# EAGLE schematic v1 (EAGLE 6.4)
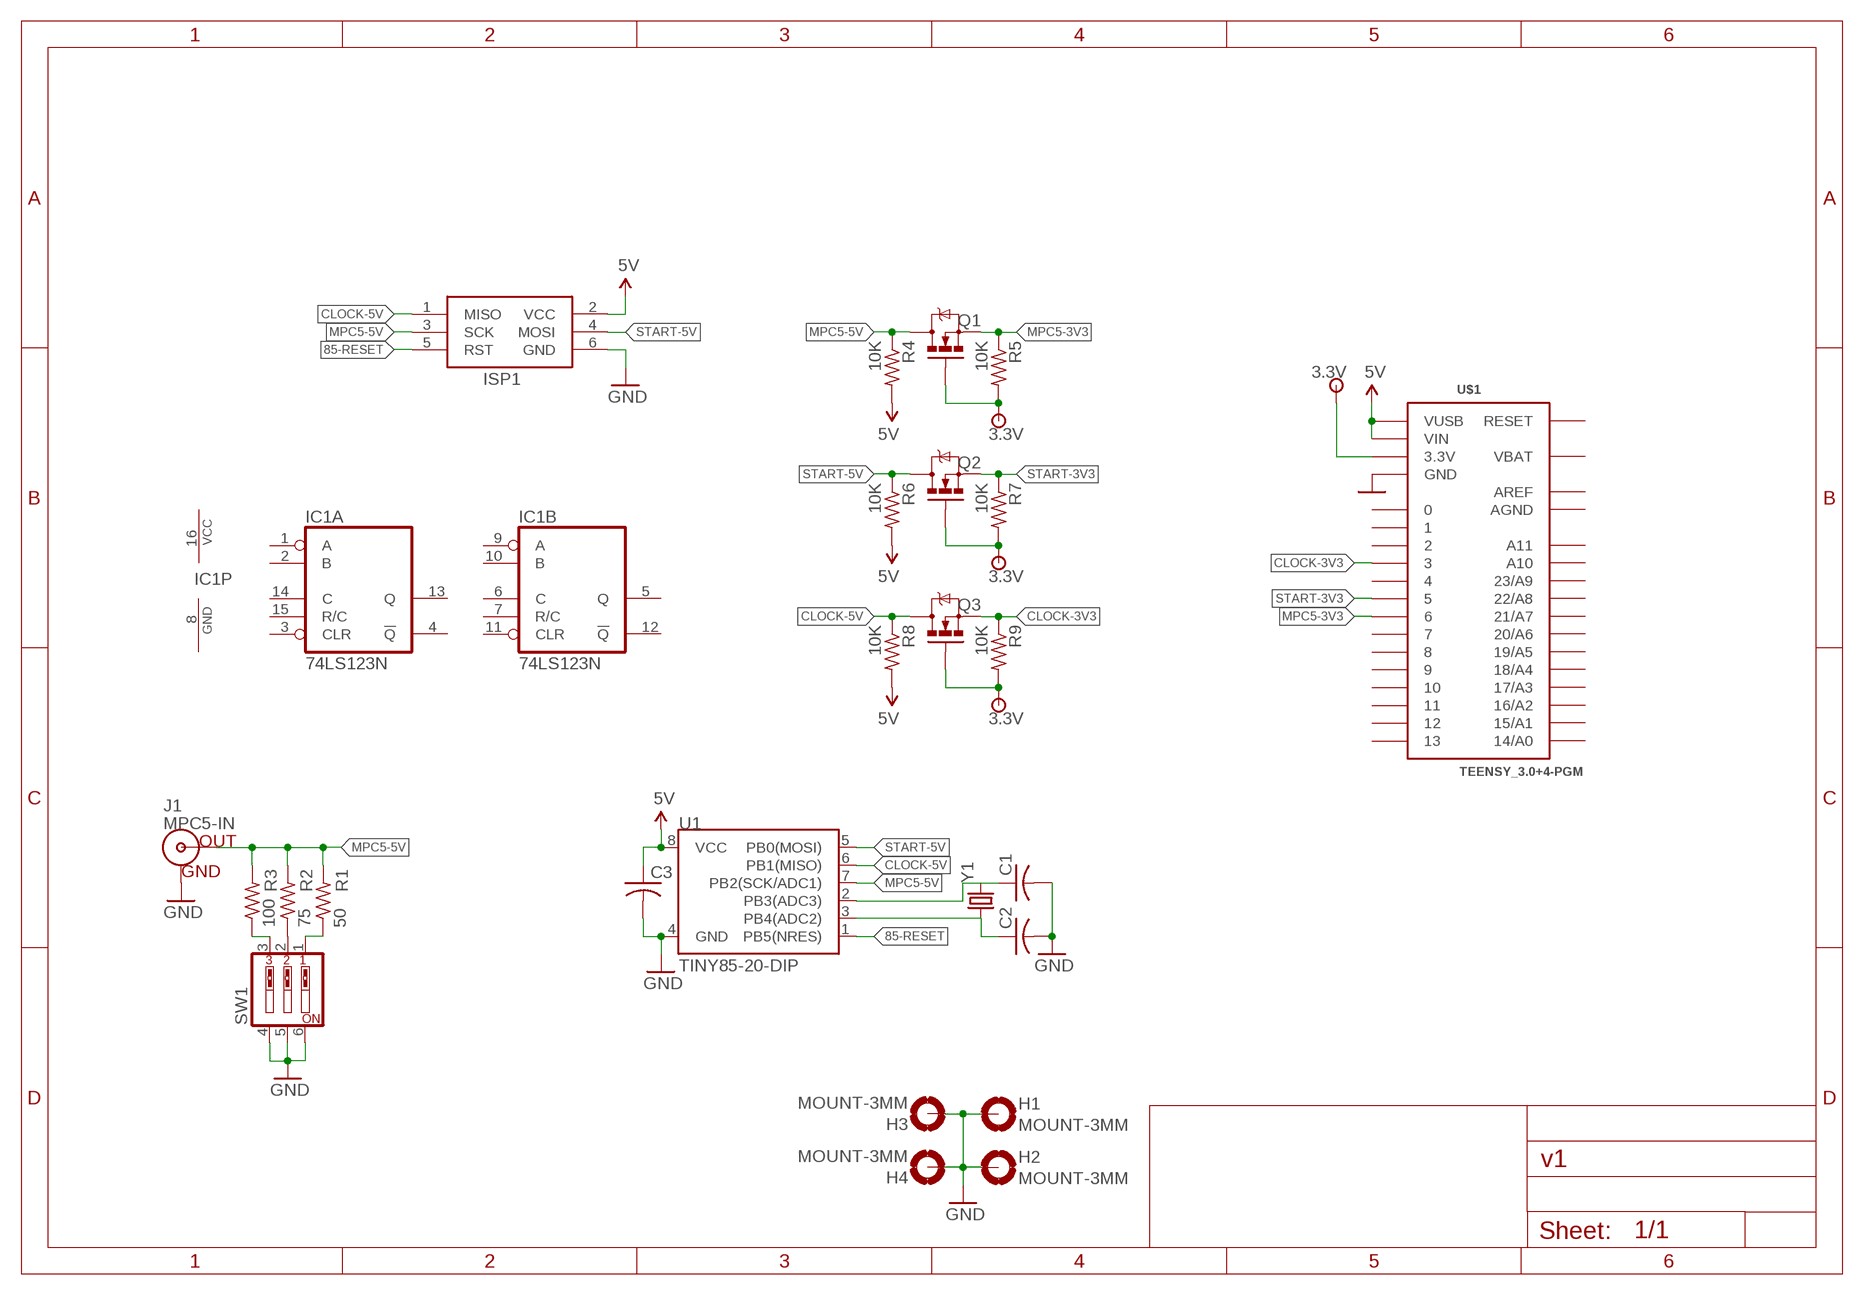
[diagram p0: schematic, sheet 1]

## Parts
C1  C-USNEWSILK  [C0805K]
C2  C-USNEWSILK  [C0805K]
C3  C-USNEWSILK  [C0805K]
H1  MOUNT-3MM  MOUNT-PAD-ROUND3.0  [3,0-PAD]
H2  MOUNT-3MM  MOUNT-PAD-ROUND3.0  [3,0-PAD]
H3  MOUNT-3MM  MOUNT-PAD-ROUND3.0  [3,0-PAD]
H4  MOUNT-3MM  MOUNT-PAD-ROUND3.0  [3,0-PAD]
IC1  74LS123N  [DIL16]
ISP1  AVRISP-6  [AVRISP]
J1  MPC5-IN  BNCPTH  [BNC]
Q1  BSS138  BSS138BSS138  [SOT23]
Q2  BSS138  BSS138BSS138  [SOT23]
Q3  BSS138  BSS138BSS138  [SOT23]
R1  50  R-US_NEWSILK  [R0805]
R2  75  R-US_NEWSILK  [R0805]
R3  100  R-US_NEWSILK  [R0805]
R4  10K  R-US_NEWSILK  [R0805]
R5  10K  R-US_NEWSILK  [R0805]
R6  10K  R-US_NEWSILK  [R0805]
R7  10K  R-US_NEWSILK  [R0805]
R8  10K  R-US_NEWSILK  [R0805]
R9  10K  R-US_NEWSILK  [R0805]
SW1  SW_DIP-3  [EDG-03]
U1  TINY85-20-DIP  ATTINY45TINY85-20-DIP  [DIP08]
U$1  TEENSY_3.0+4-PGM  [TEENSY_3.0+4-PGM]
Y1  CRYSTALHC49UV  [HC49U-V]

## Nets
3.3V: Q1.1(G) Q2.1(G) Q3.1(G) R5.2 R7.2 R9.2 U$1.3.3V U$1.3.3V1(3.3V)
5V: C3.1 ISP1.2(VCC) R4.2 R6.2 R8.2 U1.8(VCC) U$1.VIN U$1.VUSB
85-RESET: ISP1.5(RST) U1.1(PB5(NRES))
CLOCK-3V3: Q3.2(S) R9.1 U$1.3
CLOCK-5V: ISP1.1(MISO) Q3.3(D) R8.1 U1.6(PB1(MISO))
GND: C1.2 C2.2 C3.2 H1.B3,0(MOUNT) H2.B3,0(MOUNT) H3.B3,0(MOUNT) H4.B3,0(MOUNT) ISP1.6(GND) J1.GND SW1.4 SW1.5 SW1.6 U1.4(GND) U$1.GND U$1.GND1(GND)
MPC5-3V3: Q1.2(S) R5.1 U$1.6
MPC5-5V: ISP1.3(SCK) J1.S(OUT) Q1.3(D) R1.2 R2.2 R3.2 R4.1 U1.7(PB2(SCK/ADC1))
N$1: R1.1 SW1.1
N$2: R2.1 SW1.2
N$3: R3.1 SW1.3
N$4: C1.1 U1.2(PB3(ADC3)) Y1.2
N$5: C2.1 U1.3(PB4(ADC2)) Y1.1
START-3V3: Q2.2(S) R7.1 U$1.5
START-5V: ISP1.4(MOSI) Q2.3(D) R6.1 U1.5(PB0(MOSI))
Unconnected: IC1.1(A:A) IC1.2(A:B) IC1.3(A:CLR) IC1.4(A:!Q) IC1.5(B:Q) IC1.6(B:C) IC1.7(B:R/C) IC1.9(B:A) IC1.10(B:B) IC1.11(B:CLR) IC1.12(B:!Q) IC1.13(A:Q) IC1.14(A:C) IC1.15(A:R/C) U$1.0 U$1.1 U$1.2 U$1.4 U$1.7 U$1.8 U$1.9 U$1.10 U$1.11 U$1.12 U$1.13 U$1.14/A0 U$1.15/A1 U$1.16/A2 U$1.17/A3 U$1.18/A4 U$1.19/A5 U$1.20/A6 U$1.21/A7 U$1.22/A8 U$1.23/A9 U$1.A10 U$1.A11 U$1.RESET

## Power pins joined to a net without a drawn wire
AGND: U$1.AGND
AREF: U$1.AREF
GND: IC1.8(P:GND)
VBAT: U$1.VBAT
VCC: IC1.16(P:VCC)

## Library data of the parts
C1-C3 = XYKlib:C-US: CAPACITOR, American symbol
H1-H4 = holes:MOUNT-PAD-ROUND: MOUNTING PAD, round
IC1 = 74xx-us:74*123: Retriggerable monostable MULTIVIBRATOR
ISP1 = adafruit:AVRISP: AVR ISP HEADER Standard 6 pin header for AVR programming
J1 = SparkFun-Connectors:BNC: BNC Connector, Mouser Part# 5227161
Q1-Q3 = XYKlib:BSS138: BSS138 with Outline Silkscreen
R1-R9 = XYKlib:R-US_: RESISTOR, American symbol
SW1 = special:SW_DIP-3: DIP SWITCH
U1 = SparkFun-DigitalIC:ATTINY45: Atmel 8-pin 2/4/8kB flash uC; PROD_ID: IC-09445
U$1 = Teensy3.0:TEENSY_3.0+4-PGM: Teensy 3.0 board outline identical to '+4' version except that the PGM pin has been omitted. See 'AllAnalogPins" and 'AllPins' packages for additional pin holes, as needed. The 'Basic' package has fewer pins
Y1 = SparkFun-FreqCtrl:CRYSTAL: Various standard crystals. Proven footprints. Spark Fun Electronics SKU : COM-00534